# Altium schematic sheet 01-multimodal-powersupply.SchDoc
size A4; SheetNumber: 11; SheetTotal: 11
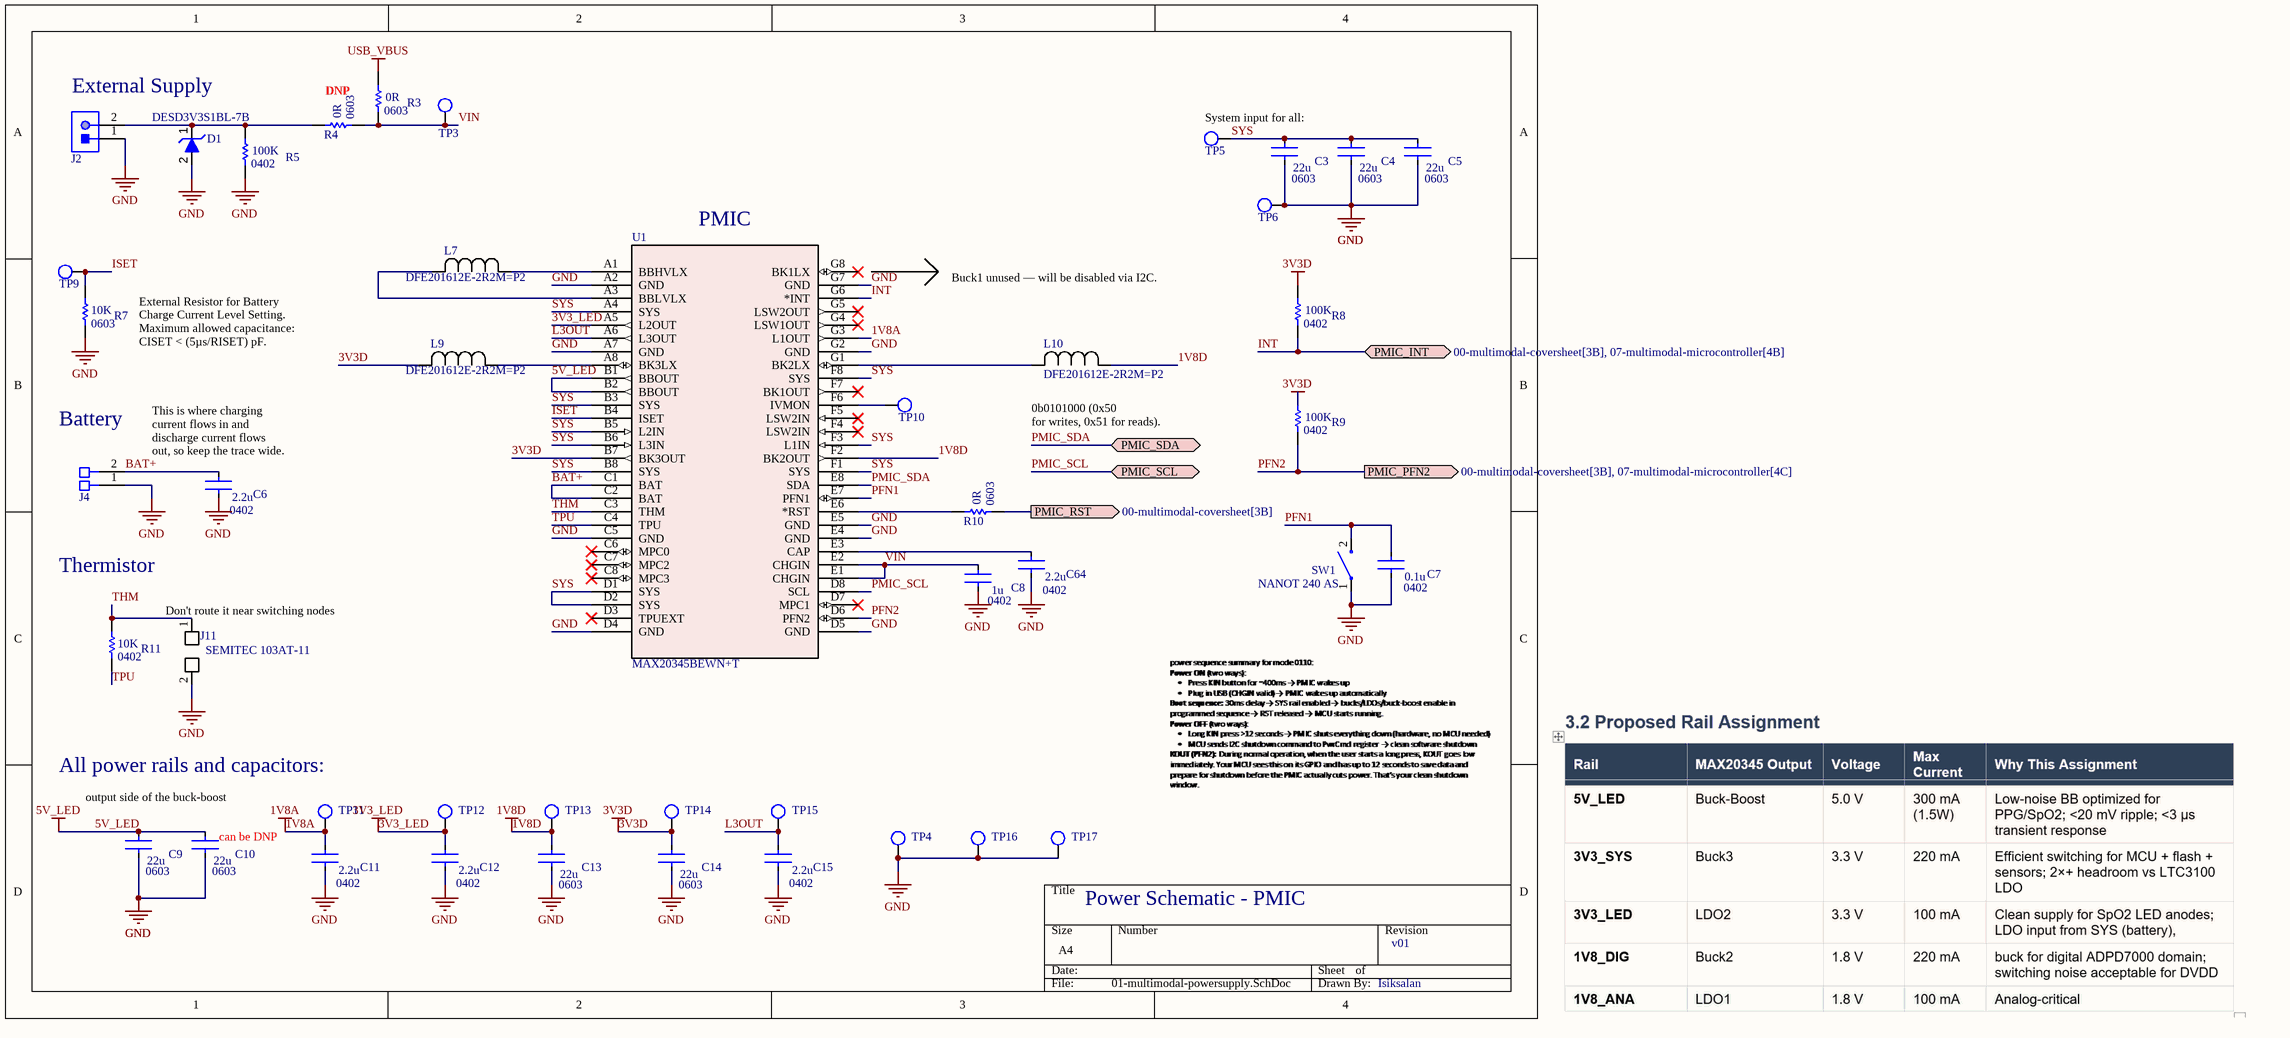
[diagram p0: 01-multimodal-powersupply.SchDoc]

## Parts
C3  GRM188R61A226ME15D  [CAPTDK0603]  (value not drawn)
C4  GRM188R61A226ME15D  [CAPTDK0603]  (value not drawn)
C5  GRM188R61A226ME15D  [CAPTDK0603]  (value not drawn)
C6  CL05A225KO5NQNC  [CAPTDK0402]  (value not drawn)
C7  C1005X7R1H104K050BB  [CAPTDK0402]  (value not drawn)
C8  C1005X5R1V105K050BC  [CAPTDK0402]  (value not drawn)
C9  GRM188R61A226ME15D  [CAPTDK0603]  (value not drawn)
C10  GRM188R61A226ME15D  [CAPTDK0603]  (value not drawn)
C11  CL05A225KO5NQNC  [CAPTDK0402]  (value not drawn)
C12  CL05A225KO5NQNC  [CAPTDK0402]  (value not drawn)
C13  GRM188R61A226ME15D  [CAPTDK0603]  (value not drawn)
C14  GRM188R61A226ME15D  [CAPTDK0603]  (value not drawn)
C15  CL05A225KO5NQNC  [CAPTDK0402]  (value not drawn)
C64  CL05A225KO5NQNC  [CAPTDK0402]  (value not drawn)
D1  DESD3V3S1BL-7B  [TVSDIODE-0402]
J2  TH-Connector  [2-PIN-TH-CONN]  (value not drawn)
J4  battery_connection  [Battery_connection]  (value not drawn)
J11  SEMITEC 103AT-11  [NTC_connection]
L7  DFE201612E-2R2M=P2  [IND_DFE2016_MUR-L]
L9  DFE201612E-2R2M=P2  [IND_DFE2016_MUR-L]
L10  DFE201612E-2R2M=P2  [IND_DFE2016_MUR-L]
R3  RMCF0603ZT0R00  [RES-STACK-POLE-0603]  (value not drawn)
R4  RMCF0603ZT0R00  [RES-STACK-POLE-0603]  (value not drawn)  (no BOM)
R5  RMCF0402FT100K  [RES-STACK-POLE-0402]  (value not drawn)
R7  RMCF0603JG10K0  [RES-STACK-POLE-0603]  (value not drawn)
R8  RMCF0402FT100K  [RES-STACK-POLE-0402]  (value not drawn)
R9  RMCF0402FT100K  [RES-STACK-POLE-0402]  (value not drawn)
R10  RMCF0603ZT0R00  [RES-STACK-POLE-0603]  (value not drawn)
R11  RMCF0402FT10K0  [RES-STACK-POLE-0402]  (value not drawn)
SW1  NANOT 240 AS  [TACTILE-SWITCH - TINY]
TP3  TESTPOINT_S  [TESTPOINT_S]  (value not drawn)  (no BOM)
TP4  TESTPOINT_S  [TESTPOINT_S]  (value not drawn)  (no BOM)
TP5  TESTPOINT_S  [TESTPOINT_S]  (value not drawn)  (no BOM)
TP6  TESTPOINT_S  [TESTPOINT_S]  (value not drawn)  (no BOM)
TP9  TESTPOINT_S  [TESTPOINT_S]  (value not drawn)  (no BOM)
TP10  TESTPOINT_S  [TESTPOINT_S]  (value not drawn)  (no BOM)
TP11  TESTPOINT_S  [TESTPOINT_S]  (value not drawn)  (no BOM)
TP12  TESTPOINT_S  [TESTPOINT_S]  (value not drawn)  (no BOM)
TP13  TESTPOINT_S  [TESTPOINT_S]  (value not drawn)  (no BOM)
TP14  TESTPOINT_S  [TESTPOINT_S]  (value not drawn)  (no BOM)
TP15  TESTPOINT_S  [TESTPOINT_S]  (value not drawn)  (no BOM)
TP16  TESTPOINT_S  [TESTPOINT_S]  (value not drawn)  (no BOM)
TP17  TESTPOINT_S  [TESTPOINT_S]  (value not drawn)  (no BOM)
U1  MAX20345BEWN+T  [21-100260_W563H3+1_ADI]

## Ports
PMIC_INT (bidir, see 00-multimodal-coversheet[3B], 07-multimodal-microcontroller[4B]), PMIC_PFN2 (out, see 00-multimodal-coversheet[3B], 07-multimodal-microcontroller[4C]), PMIC_RST (out, see 00-multimodal-coversheet[3B]), PMIC_SCL (bidir, see 00-multimodal-coversheet[3B]), PMIC_SDA (bidir, see 00-multimodal-coversheet[3B])

## Nets
1V8A: C11.1 TP11.1 U1.G3(L1OUT)
1V8D: C13.1 L10.1 TP13.1 U1.F2(BK2OUT)
3V3_LED: C12.1 TP12.1 U1.A5(L2OUT)
3V3D: C14.1 L9.2 R8.2 R9.2 TP14.1 U1.B7(BK3OUT)
5V_LED: C9.1 C10.1 U1.B1(BBOUT) U1.B2(BBOUT)
GND: C3.2 C4.2 C5.2 C6.2 C7.2 C8.2 C9.2 C10.2 C11.2 C12.2 C13.2 C14.2 C15.2 C64.2 D1.2 J2.1 J4.1 J11.2 R5.1 R7.1 SW1.1 TP4.1 TP6.1 TP16.1 TP17.1 U1.A2(GND) U1.A7(GND) U1.C5(GND) U1.D4(GND) U1.D5(GND) U1.E4(GND) U1.E5(GND) U1.G2(GND) U1.G7(GND)
USB_VBUS: R3.2
BAT+: C6.1 J4.2 U1.C1(BAT) U1.C2(BAT)
INT: R8.1 U1.G6(*INT) ; port PMIC_INT
ISET: R7.2 TP9.1 U1.B4(ISET)
L3OUT: C15.1 TP15.1 U1.A6(L3OUT)
PFN1: C7.1 SW1.2 U1.E7(PFN1)
PFN2: R9.1 U1.D6(PFN2) ; port PMIC_PFN2
PMIC_RST: R10.1 ; port PMIC_RST
PMIC_SCL: U1.D8(SCL) ; port PMIC_SCL
PMIC_SDA: U1.E8(SDA) ; port PMIC_SDA
SYS: C3.1 C4.1 C5.1 TP5.1 U1.A4(SYS) U1.B3(SYS) U1.B5(L2IN) U1.B6(L3IN) U1.B8(SYS) U1.D1(SYS) U1.D2(SYS) U1.F1(SYS) U1.F3(L1IN) U1.F8(SYS)
THM: J11.1 R11.2 U1.C3(THM)
TPU: R11.1 U1.C4(TPU)
VIN: C8.1 R3.1 R4.1 TP3.1 U1.E1(CHGIN) U1.E2(CHGIN)
NetC64_1: C64.1 U1.E3(CAP)
NetD1_1: D1.1 J2.2 R4.2 R5.2
NetL7_1: L7.1 U1.A1(BBHVLX)
NetL7_2: L7.2 U1.A3(BBLVLX)
NetL9_1: L9.1 U1.A8(BK3LX)
NetL10_2: L10.2 U1.G1(BK2LX)
NetR10_2: R10.2 U1.E6(*RST)
NetTP10_1: TP10.1 U1.F6(IVMON)

Not connected (* = marked no-connect by the designer): U1 C6(MPC0)* C7(MPC2)* C8(MPC3)* D3(TPUEXT)* D7(MPC1)* F4(LSW2IN)* F5(LSW2IN)* F7(BK1OUT)* G4(LSW1OUT)* G5(LSW2OUT)* G8(BK1LX)*

## Notes on the sheet
- External Supply
- DNP
- System input for all:
- (near U1) PMIC
- Buck1 unused — will be disabled via I2C.
- External Resistor for Battery Charge Current Level Setting.
  Maximum allowed capacitance: CISET < (5µs/RISET) pF.
- (near J4) Battery
- (near L10) 0b0101000 (0x50
  for writes, 0x51 for reads).
- (near C6) This is where charging current flows in and discharge current flows out, so keep the trace wide.
- Thermistor
- (near J11) Don't route it near switching nodes
- All power rails and capacitors:
- output side of the buck-boost
- (near C10) can be DNP
- (near TP17) Power Schematic - PMIC
- v01
- Isiksalan
- (in symbol C1005X5R1V105K050BC) 1u; 0402
- (in symbol C1005X7R1H104K050BB) 0.1u; 0402
- (in symbol CL05A225KO5NQNC) 2.2u; 0402
- (in symbol GRM188R61A226ME15D) 22u; 0603
- (in symbol RMCF0402FT10K0) 10K; 0402
- (in symbol RMCF0402FT100K) 100K; 0402
- (in symbol RMCF0603JG10K0) 10K; 0603
- (in symbol RMCF0603ZT0R00) 0R; 0603

## Library data of the parts
C3-C5 C9 C10 C13 C14 = GRM188R61A226ME15D: CAP CER 22UF 10V X5R 0603; Supplier 1: Avnet; Supplier Part Number 1: GRM188R61A226ME15D
C6 C11 C12 C15 C64 = CL05A225KO5NQNC: CAP CER 2.2UF 16V X5R 0402; Supplier 1: Avnet; Supplier Part Number 1: CL05A225KO5NQNC
C7 = C1005X7R1H104K050BB: CAP CER 0.1UF 50V X7R 0402; Supplier 1: Digi-Key; Supplier Part Number 1: 445-5932-1-ND
C8 = C1005X5R1V105K050BC: CAP CER 1UF 35V X5R 0402; Supplier 1: Digi-Key; Supplier Part Number 1: 445-9073-1-ND
D1 = DESD3V3S1BL-7B: TVS DIODE 3.3V 7V DFN1006-2; Manufacturer: Diodes; Direction: Bidirectional; Number of Bidirectional Channels: 1; Min Breakdown Voltage: 3.8V; Peak Pulse Power: 35W; Power Line Protection: No; Max Reverse Leakage Current: 100nA; Element Configuration: Single; Breakdown Voltage: 6.5V; Peak Pulse Current: 5A; Supplier 1: Digi-Key; Manufacturer Part Number: DESD3V3S1BL-7B; RoHS: Yes; Category: TVS Diodes; Stock 1: 514017; Pricing 1: 1=0.32000, 10=0.26000, 100=0.13790, 500=0.09076, 1000=0.06171, 2000=0.05566, 5000=0.04840 (USD); Mount: Surface Mount; Number of Pins: 2; Min Operating Temperature: -65°C; Max Operating Temperature: 150°C; Packaging: Tape and Reel; Package Quantity: 10000; Reverse Standoff Voltage: 3.3V; Clamping Voltage: 7V; Polarity: Bidirectional; Termination: SMD/SMT; Working Voltage: 3.3V; Max Power Dissipation: 35W; Resistor Type: Zener; Radiation Hardening: No; RoHS Compliant: Yes; ComponentLink1URL: https://www.diodes.com/assets/Datasheets/DESD3V3S1BL.pdf; ComponentLink1Description: Datasheet; Supplier Part Number 1: DESD3V3S1BL-7BDICT-ND; ComponentLink2Description: New link; ComponentLink2URL: *
J2 = TH-Connector: Power Connector
J11 = SEMITEC 103AT-11: NTC THERMISTOR 10KOHM 1%
L7 L9 L10 = DFE201612E-2R2M=P2: 2.2 µH Shielded Drum Core, Wirewound Inductor 1.8 A 116mOhm Max 0806 (2016 Metric); Manufacturer_Name: Murata; Type: Fixed Inductors; Copyright: Copyright (C) 2025 Ultra Librarian. All rights reserved.; Manufacturer_Part_Number: DFE201612E-2R2M=P2
R3 R4 R10 = RMCF0603ZT0R00: RES 0 OHM JUMPER 1/10W 0603; Supplier 1: Digi-Key; Supplier Part Number 1: RMCF0603ZT0R00CT-ND
R5 R8 R9 = RMCF0402FT100K: RES 100K OHM 1% 1/16W 0402; Supplier 1: Digi-Key; Supplier Part Number 1: RMCF0402FT100KCT-ND
R7 = RMCF0603JG10K0: RES 10K OHM 5% 1/10W 0603; Supplier 1: Digi-Key; Supplier Part Number 1: 738-RMCF0603JG10K0CT-ND
R11 = RMCF0402FT10K0: RES 10K OHM 1% 1/16W 0402; Supplier 1: Digi-Key; Supplier Part Number 1: RMCF0402FT10K0CT-ND
SW1 = NANOT 240 AS: SWITCH TACTILE SPST-NO 0.02A 15V; Supplier 1: Future Electronics; Supplier Part Number 1: 2189518
TP3-TP6 TP9-TP17 = TESTPOINT_S: Testpoint Surface Pad
U1 = MAX20345BEWN+T: PMIC with Ultra-Low IQ Voltage Regulators, Buck-Boost for Optical Sensing and Charger for Small Lithium Ion Systems; Manufacturer_Name: Analog Devices Inc; Manufacturer_Part_Number: MAX20345KEWN+T; Copyright: Copyright (C) 2026 Ultra Librarian. All rights reserved.; RefDes: RefDes; Type: Type; Supplier 1: DigiKey; Supplier Part Number 1: 505-MAX20345BEWN+TTR-ND